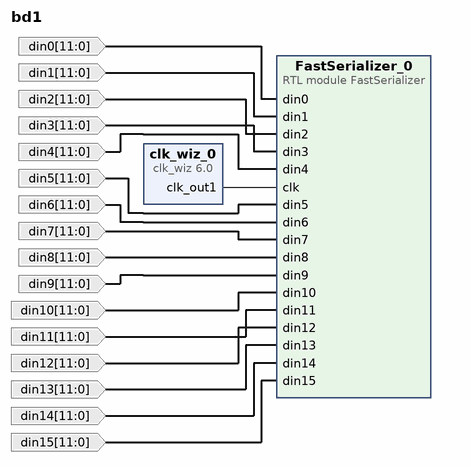
[diagram p0: block diagram of the top level]
# Vivado block design bd1, xc7z020clg400-1, Vivado 2019.1
create_bd_design bd1

create_bd_port -dir I -from 11 -to 0 din0
create_bd_port -dir I -from 11 -to 0 din1
create_bd_port -dir I -from 11 -to 0 din2
create_bd_port -dir I -from 11 -to 0 din3
create_bd_port -dir I -from 11 -to 0 din4
create_bd_port -dir I -from 11 -to 0 din5
create_bd_port -dir I -from 11 -to 0 din6
create_bd_port -dir I -from 11 -to 0 din7
create_bd_port -dir I -from 11 -to 0 din8
create_bd_port -dir I -from 11 -to 0 din9
create_bd_port -dir I -from 11 -to 0 din10
create_bd_port -dir I -from 11 -to 0 din11
create_bd_port -dir I -from 11 -to 0 din12
create_bd_port -dir I -from 11 -to 0 din13
create_bd_port -dir I -from 11 -to 0 din14
create_bd_port -dir I -from 11 -to 0 din15

create_bd_cell -type ip -vlnv xilinx.com:ip:clk_wiz:6.0 clk_wiz_0
set_property -dict [list \
  CONFIG.CLKOUT1_JITTER 229.865 \
  CONFIG.CLKOUT1_PHASE_ERROR 301.601 \
  CONFIG.CLKOUT1_REQUESTED_OUT_FREQ 192.000 \
  CONFIG.MMCM_CLKFBOUT_MULT_F 48.000 \
  CONFIG.MMCM_CLKOUT0_DIVIDE_F 5.000 \
  CONFIG.MMCM_DIVCLK_DIVIDE 5 \
  CONFIG.USE_LOCKED false \
] [get_bd_cells clk_wiz_0]
create_bd_cell -type module -reference FastSerializer FastSerializer_0

# ---- connections ----

connect_bd_net [get_bd_pins clk_wiz_0/clk_out1] [get_bd_pins FastSerializer_0/clk]
connect_bd_net -net din0_1 [get_bd_ports din0] [get_bd_pins FastSerializer_0/din0]
connect_bd_net -net din1_1 [get_bd_ports din1] [get_bd_pins FastSerializer_0/din1]
connect_bd_net -net din2_1 [get_bd_ports din2] [get_bd_pins FastSerializer_0/din2]
connect_bd_net -net din3_1 [get_bd_ports din3] [get_bd_pins FastSerializer_0/din3]
connect_bd_net -net din4_1 [get_bd_ports din4] [get_bd_pins FastSerializer_0/din4]
connect_bd_net -net din5_1 [get_bd_ports din5] [get_bd_pins FastSerializer_0/din5]
connect_bd_net -net din6_1 [get_bd_ports din6] [get_bd_pins FastSerializer_0/din6]
connect_bd_net -net din7_1 [get_bd_ports din7] [get_bd_pins FastSerializer_0/din7]
connect_bd_net -net din8_1 [get_bd_ports din8] [get_bd_pins FastSerializer_0/din8]
connect_bd_net -net din9_1 [get_bd_ports din9] [get_bd_pins FastSerializer_0/din9]
connect_bd_net -net din10_1 [get_bd_ports din10] [get_bd_pins FastSerializer_0/din10]
connect_bd_net -net din11_1 [get_bd_ports din11] [get_bd_pins FastSerializer_0/din11]
connect_bd_net -net din12_1 [get_bd_ports din12] [get_bd_pins FastSerializer_0/din12]
connect_bd_net -net din13_1 [get_bd_ports din13] [get_bd_pins FastSerializer_0/din13]
connect_bd_net -net din14_1 [get_bd_ports din14] [get_bd_pins FastSerializer_0/din14]
connect_bd_net -net din15_1 [get_bd_ports din15] [get_bd_pins FastSerializer_0/din15]

validate_bd_design
save_bd_design
